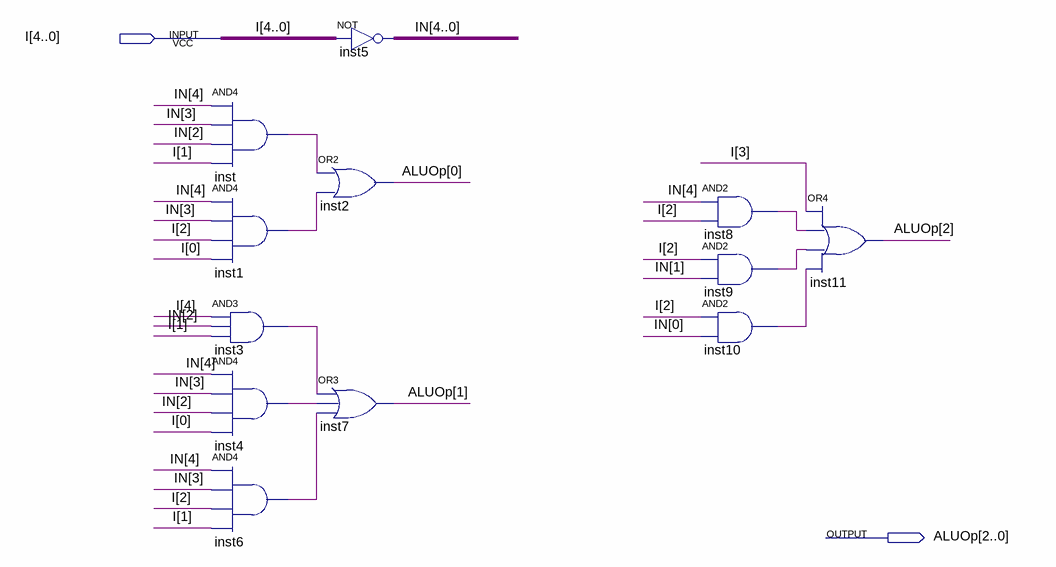
[diagram p0: schematic sheet]
// Quartus schematic ALUOp.bdf as structural Verilog: 12 symbols, 2 pins
module ALUOp (
  input  [4:0] I,
  output [2:0] ALUOp
);

  wire inst1_out, inst3_out, inst4_out, inst6_out, inst8_out, inst9_out, inst10_out, inst_out;
  wire [4:0] IN;

  and inst (inst_out, IN[4], IN[3], IN[2], I[1]);
  and inst1 (inst1_out, IN[4], IN[3], I[2], I[0]);
  and inst3 (inst3_out, I[4], IN[2], I[1]);
  and inst4 (inst4_out, IN[4], IN[3], IN[2], I[0]);
  and inst6 (inst6_out, IN[4], IN[3], I[2], I[1]);
  or inst2 (ALUOp[0], inst_out, inst1_out);
  or inst7 (ALUOp[1], inst3_out, inst4_out, inst6_out);
  assign IN = ~I;  // NOT inst5, 5 bits wide
  and inst8 (inst8_out, IN[4], I[2]);
  and inst9 (inst9_out, I[2], IN[1]);
  and inst10 (inst10_out, I[2], IN[0]);
  or inst11 (ALUOp[2], I[3], inst8_out, inst9_out, inst10_out);
endmodule
